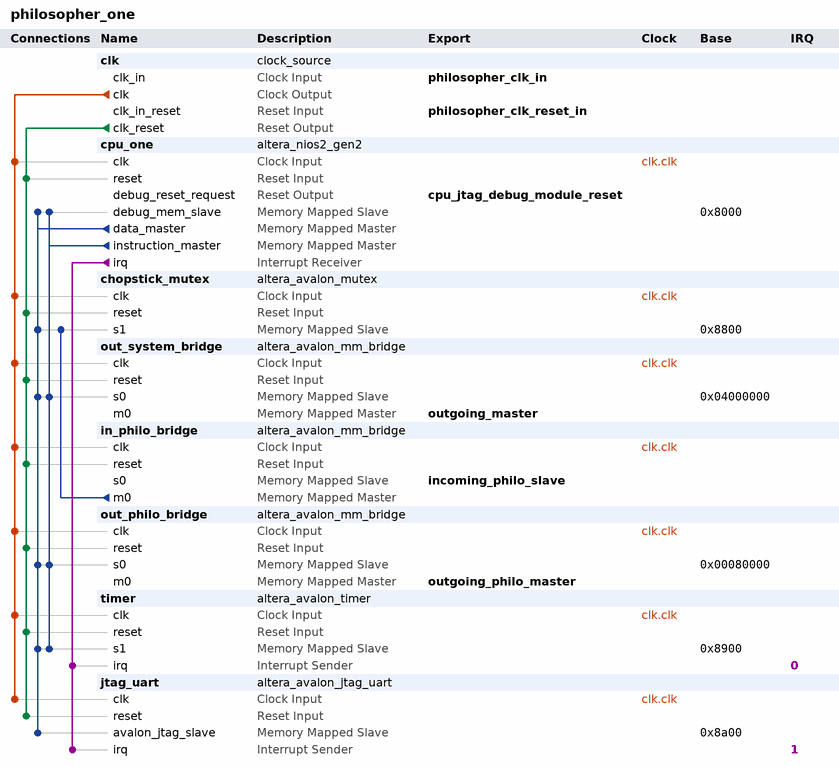
[diagram p0: system contents]
# Platform Designer (Qsys) system philosopher_one, Cyclone 10 LP 10CL025YU256I7G
# Parameters at their usual value, and those the tool derives, are not listed.
package require -exact qsys 17.0
create_system philosopher_one
set_project_property DEVICE_FAMILY {Cyclone 10 LP}
set_project_property DEVICE 10CL025YU256I7G

add_instance clk clock_source 17.0
set_instance_parameter_value clk clockFrequency 50000000

add_instance cpu_one altera_nios2_gen2 17.0
set_instance_parameter_value cpu_one cpuID 1
set_instance_parameter_value cpu_one dcache_size 2048
set_instance_parameter_value cpu_one exceptionOffset 67444768
set_instance_parameter_value cpu_one exceptionSlave Absolute
set_instance_parameter_value cpu_one icache_size 4096
set_instance_parameter_value cpu_one impl Tiny
set_instance_parameter_value cpu_one resetOffset 67444736
set_instance_parameter_value cpu_one resetSlave Absolute

add_instance chopstick_mutex altera_avalon_mutex 17.0

add_instance out_system_bridge altera_avalon_mm_bridge 17.0
set_instance_parameter_value out_system_bridge ADDRESS_UNITS SYMBOLS
set_instance_parameter_value out_system_bridge ADDRESS_WIDTH 26
set_instance_parameter_value out_system_bridge DATA_WIDTH 32
set_instance_parameter_value out_system_bridge MAX_PENDING_RESPONSES 4
set_instance_parameter_value out_system_bridge USE_AUTO_ADDRESS_WIDTH 0

add_instance in_philo_bridge altera_avalon_mm_bridge 17.0
set_instance_parameter_value in_philo_bridge ADDRESS_UNITS SYMBOLS
set_instance_parameter_value in_philo_bridge ADDRESS_WIDTH 16
set_instance_parameter_value in_philo_bridge DATA_WIDTH 32
set_instance_parameter_value in_philo_bridge MAX_PENDING_RESPONSES 4
set_instance_parameter_value in_philo_bridge USE_AUTO_ADDRESS_WIDTH 0

add_instance out_philo_bridge altera_avalon_mm_bridge 17.0
set_instance_parameter_value out_philo_bridge ADDRESS_UNITS SYMBOLS
set_instance_parameter_value out_philo_bridge ADDRESS_WIDTH 19
set_instance_parameter_value out_philo_bridge DATA_WIDTH 32
set_instance_parameter_value out_philo_bridge MAX_PENDING_RESPONSES 4
set_instance_parameter_value out_philo_bridge USE_AUTO_ADDRESS_WIDTH 0

add_instance timer altera_avalon_timer 17.0
set_instance_parameter_value timer period 10
set_instance_parameter_value timer periodUnits MSEC

add_instance jtag_uart altera_avalon_jtag_uart 17.0
set_instance_parameter_value jtag_uart simInteractiveOptions INTERACTIVE_ASCII_OUTPUT

# connections
add_connection clk.clk chopstick_mutex.clk clock
add_connection clk.clk cpu_one.clk clock
add_connection clk.clk in_philo_bridge.clk clock
add_connection clk.clk jtag_uart.clk clock
add_connection clk.clk out_philo_bridge.clk clock
add_connection clk.clk out_system_bridge.clk clock
add_connection clk.clk timer.clk clock
add_connection clk.clk_reset chopstick_mutex.reset reset
add_connection clk.clk_reset cpu_one.reset reset
add_connection clk.clk_reset in_philo_bridge.reset reset
add_connection clk.clk_reset jtag_uart.reset reset
add_connection clk.clk_reset out_philo_bridge.reset reset
add_connection clk.clk_reset out_system_bridge.reset reset
add_connection clk.clk_reset timer.reset reset
add_connection cpu_one.data_master chopstick_mutex.s1 avalon
set_connection_parameter_value cpu_one.data_master/chopstick_mutex.s1 baseAddress 0x8800
add_connection cpu_one.data_master cpu_one.debug_mem_slave avalon
set_connection_parameter_value cpu_one.data_master/cpu_one.debug_mem_slave baseAddress 0x8000
add_connection cpu_one.data_master jtag_uart.avalon_jtag_slave avalon
set_connection_parameter_value cpu_one.data_master/jtag_uart.avalon_jtag_slave baseAddress 0x8a00
add_connection cpu_one.data_master out_philo_bridge.s0 avalon
set_connection_parameter_value cpu_one.data_master/out_philo_bridge.s0 baseAddress 0x00080000
add_connection cpu_one.data_master out_system_bridge.s0 avalon
set_connection_parameter_value cpu_one.data_master/out_system_bridge.s0 baseAddress 0x04000000
add_connection cpu_one.data_master timer.s1 avalon
set_connection_parameter_value cpu_one.data_master/timer.s1 baseAddress 0x8900
add_connection cpu_one.instruction_master cpu_one.debug_mem_slave avalon
set_connection_parameter_value cpu_one.instruction_master/cpu_one.debug_mem_slave baseAddress 0x8000
add_connection cpu_one.instruction_master out_philo_bridge.s0 avalon
set_connection_parameter_value cpu_one.instruction_master/out_philo_bridge.s0 baseAddress 0x00080000
add_connection cpu_one.instruction_master out_system_bridge.s0 avalon
set_connection_parameter_value cpu_one.instruction_master/out_system_bridge.s0 baseAddress 0x04000000
add_connection cpu_one.instruction_master timer.s1 avalon
set_connection_parameter_value cpu_one.instruction_master/timer.s1 baseAddress 0x8900
add_connection in_philo_bridge.m0 chopstick_mutex.s1 avalon
set_connection_parameter_value in_philo_bridge.m0/chopstick_mutex.s1 baseAddress 0x8800
add_connection cpu_one.irq jtag_uart.irq interrupt
set_connection_parameter_value cpu_one.irq/jtag_uart.irq irqNumber 1
add_connection cpu_one.irq timer.irq interrupt
set_connection_parameter_value cpu_one.irq/timer.irq irqNumber 0

# exported interfaces
add_interface cpu_jtag_debug_module_reset reset source
set_interface_property cpu_jtag_debug_module_reset EXPORT_OF cpu_one.debug_reset_request
add_interface incoming_philo_slave avalon slave
set_interface_property incoming_philo_slave EXPORT_OF in_philo_bridge.s0
add_interface outgoing_master avalon master
set_interface_property outgoing_master EXPORT_OF out_system_bridge.m0
add_interface outgoing_philo_master avalon master
set_interface_property outgoing_philo_master EXPORT_OF out_philo_bridge.m0
add_interface philosopher_clk_in clock sink
set_interface_property philosopher_clk_in EXPORT_OF clk.clk_in
add_interface philosopher_clk_reset_in reset sink
set_interface_property philosopher_clk_reset_in EXPORT_OF clk.clk_in_reset

set_interconnect_requirement {$system} qsys_mm.clockCrossingAdapter HANDSHAKE
set_interconnect_requirement {$system} qsys_mm.maxAdditionalLatency 1

save_system philosopher_one.qsys
